# EAGLE design RPi_SPI_outputs_v04 (EAGLE 7.2.0)
AUTHOR: M.Petrilak; VERSION: 04
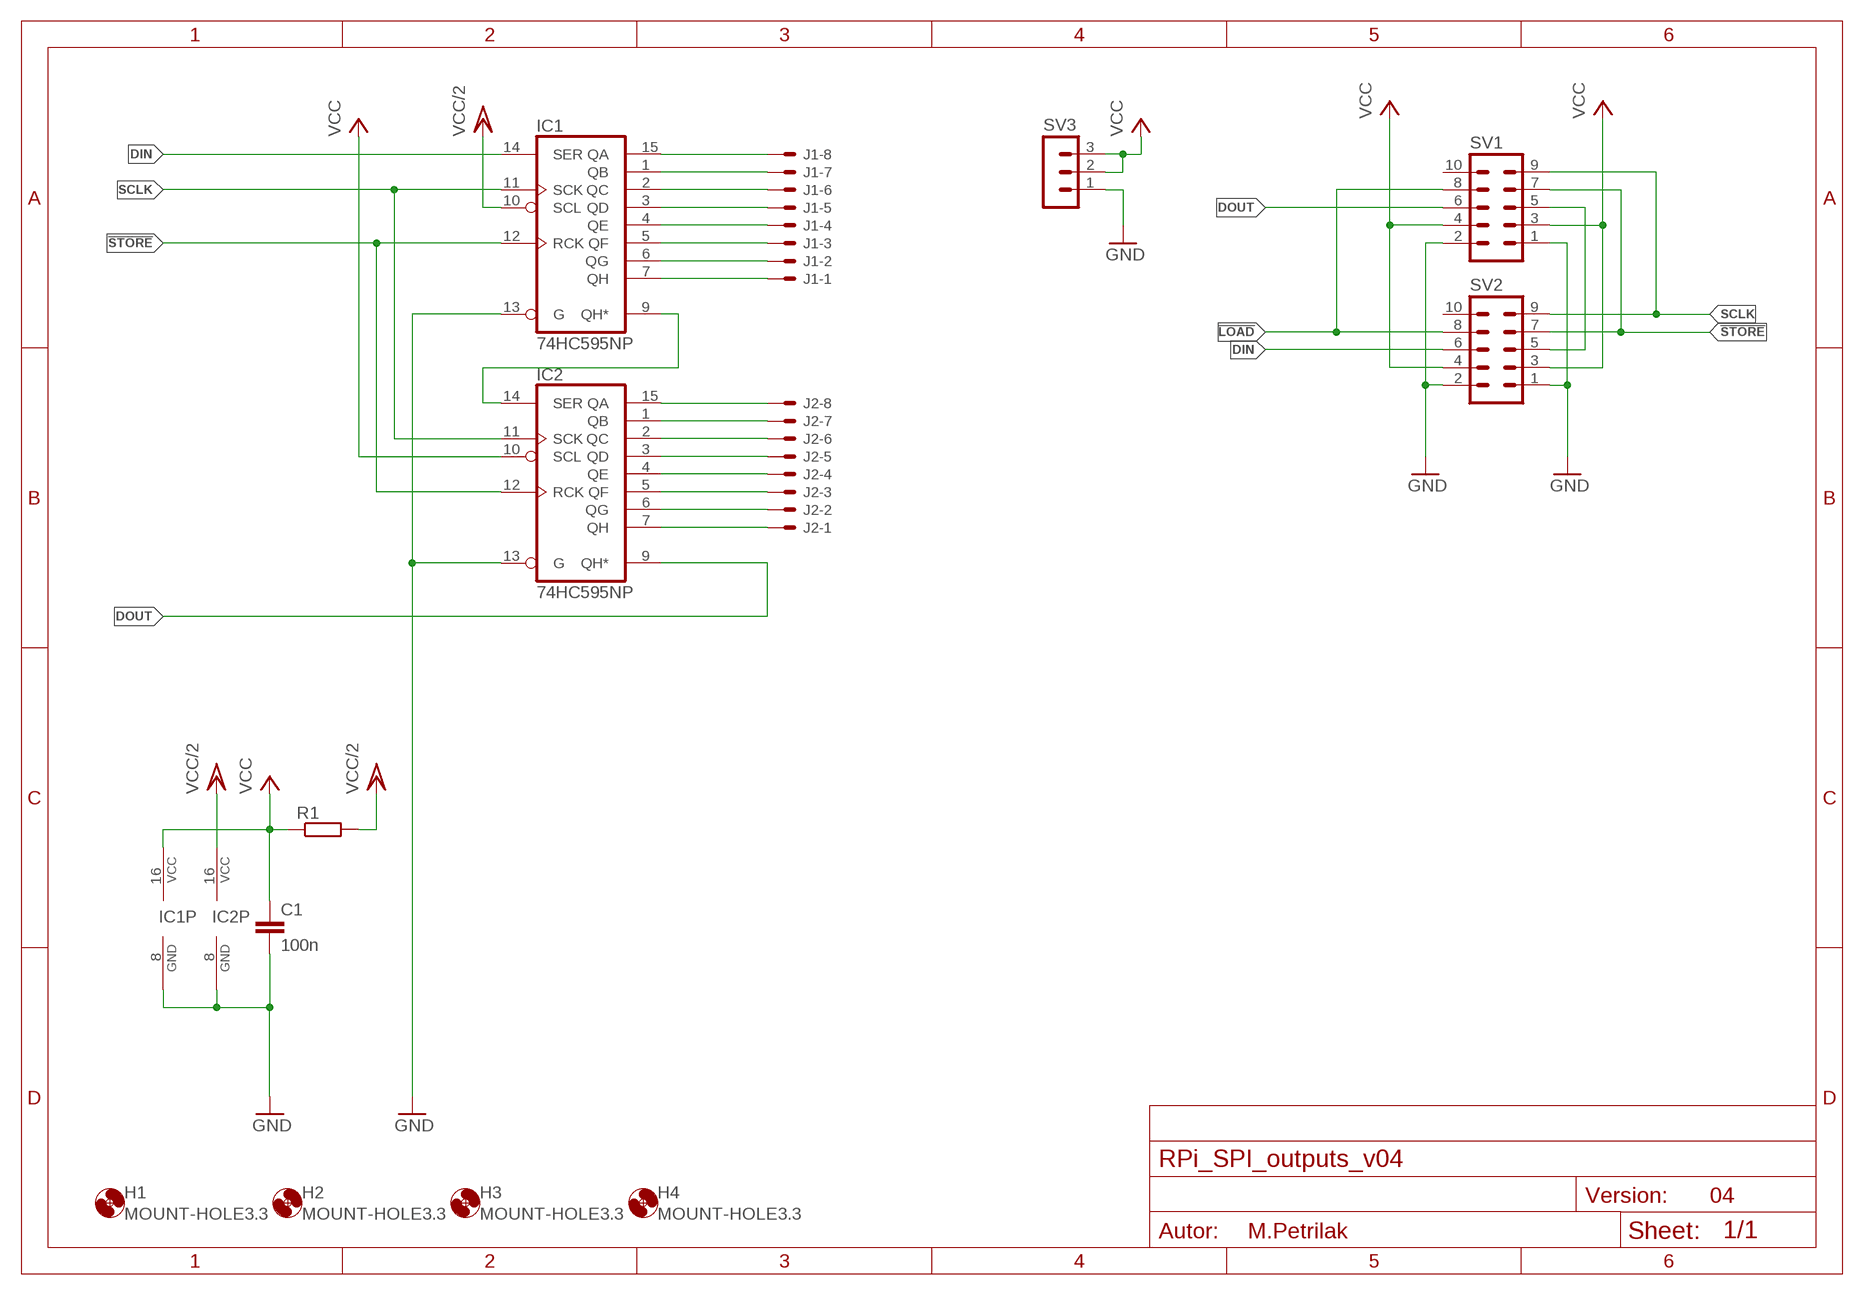
[diagram p0: schematic, sheet 1]

## Parts
C1  100n  C-EUC1206  [C1206]
H1  MOUNT-HOLE3.3  [3,3]
H2  MOUNT-HOLE3.3  [3,3]
H3  MOUNT-HOLE3.3  [3,3]
H4  MOUNT-HOLE3.3  [3,3]
IC1  74HC595NP  [SOCKET-16]
IC2  74HC595NP  [SOCKET-16]
J1  22-05-7088-SPEC-08  [7395-08_SPEC]
J2  22-05-7088-SPEC-08  [7395-08_SPEC]
R1  R-EU_R1206  [R1206]
SV1  ML10  [ML10]
SV2  ML10  [ML10]
SV3  MA03-1_NO  [MA03-1_NO]

## Nets
!LOAD: SV1.8 SV2.8
!STORE: IC1.12(RCK) IC2.12(RCK) SV1.7 SV2.7
DIN: IC1.14(SER) SV2.6
DOUT: IC2.9(QH*) SV1.6
DRET: SV1.5 SV2.5
GND: C1.2 IC1.8(GND) IC1.13(G) IC2.8(GND) IC2.13(G) SV1.1 SV1.2 SV2.1 SV2.2 SV3.1
N$1: IC1.15(QA) J1.8
N$2: IC1.1(QB) J1.7
N$3: IC1.2(QC) J1.6
N$4: IC1.3(QD) J1.5
N$5: IC1.4(QE) J1.4
N$6: IC1.5(QF) J1.3
N$7: IC1.6(QG) J1.2
N$8: IC1.7(QH) J1.1
N$9: IC2.15(QA) J2.8
N$10: IC2.1(QB) J2.7
N$11: IC2.2(QC) J2.6
N$12: IC2.3(QD) J2.5
N$13: IC2.4(QE) J2.4
N$14: IC2.5(QF) J2.3
N$15: IC2.6(QG) J2.2
N$16: IC2.7(QH) J2.1
N$17: IC1.9(QH*) IC2.14(SER)
SCLK: IC1.11(SCK) IC2.11(SCK) SV1.9 SV2.9
VCC: C1.1 IC1.16(VCC) IC2.10(SCL) R1.1 SV1.3 SV1.4 SV2.3 SV2.4 SV3.2 SV3.3
VCC/2: IC1.10(SCL) IC2.16(VCC) R1.2
Unconnected: SV1.10 SV2.10

## Library data of the parts
C1 = rcl:C-EU: CAPACITOR, European symbol
H1-H4 = holes:MOUNT-HOLE: MOUNTING HOLE with drill center marker
IC1 IC2 = 74xx-us:74*595: 8-bit SHIFT REGISTER, output latch
J1 J2 = con-molex:22-?-08: CONNECTOR wire to board 2.54 mm (.1 inch) pitch header
R1 = rcl:R-EU_: RESISTOR, European symbol
SV1 SV2 = con-harting-ml:ML10: HARTING
SV3 = con-lstb:MA03-1: PIN HEADER

## Board
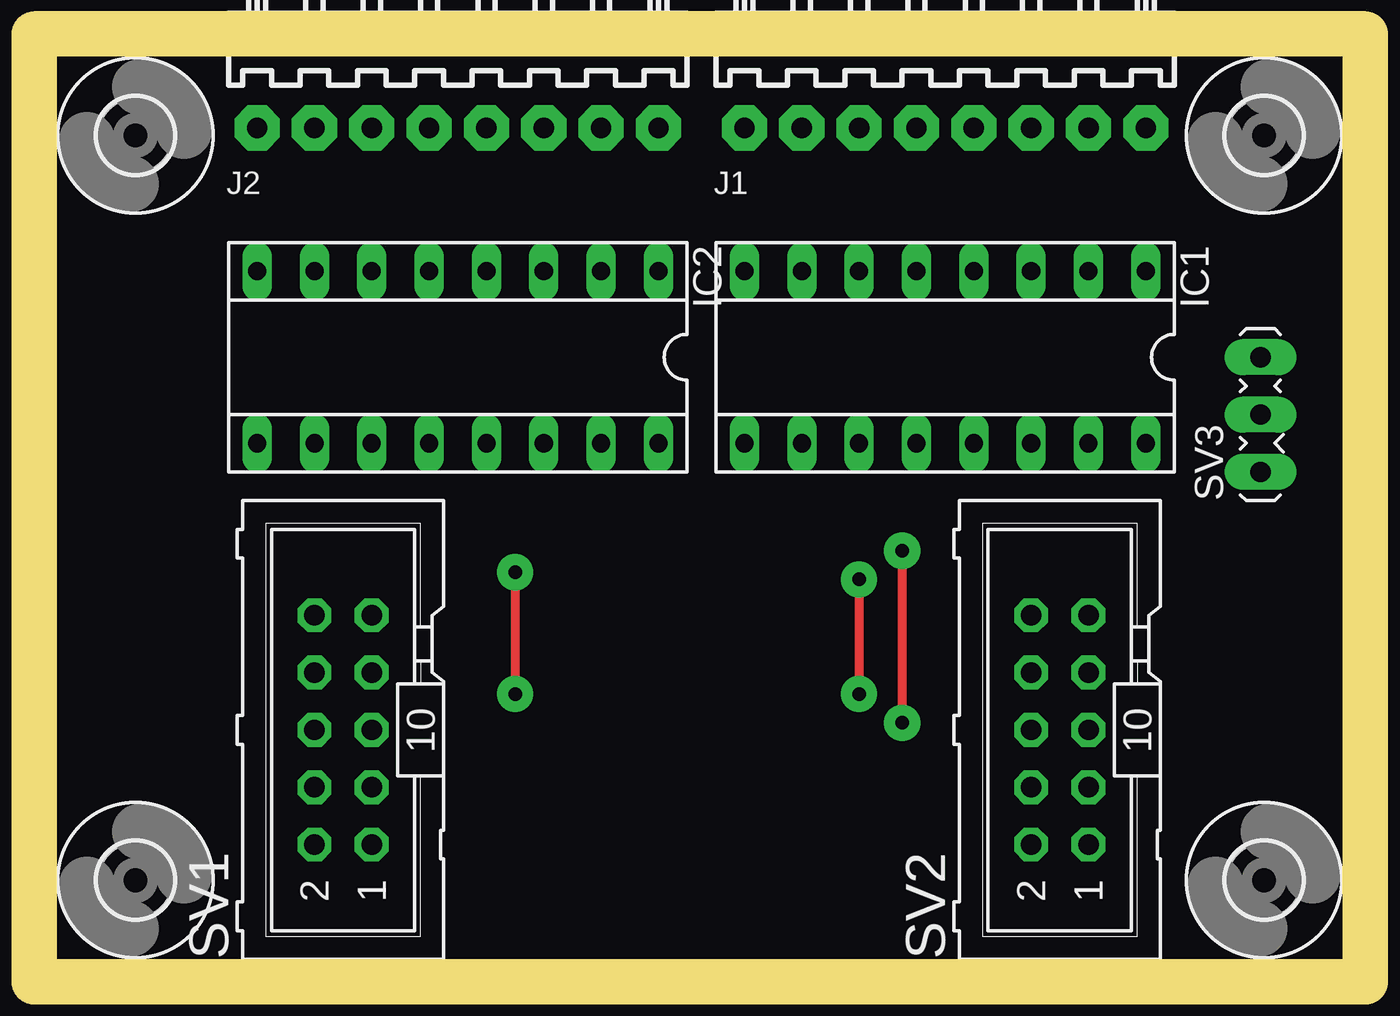
[diagram p1: board, top side]
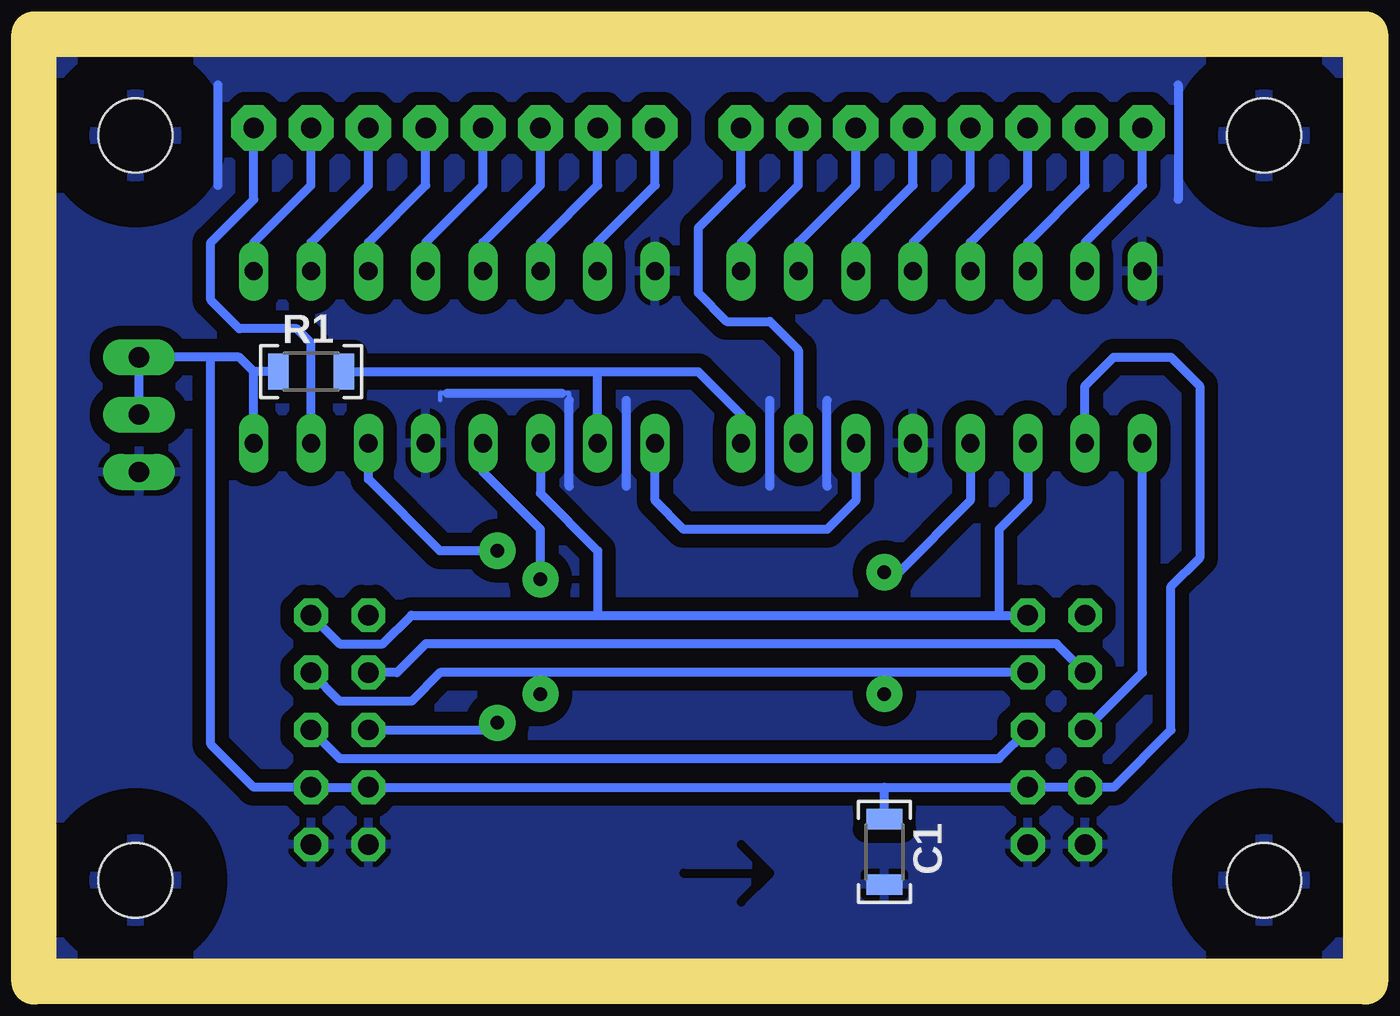
[diagram p2: board, bottom side, seen from below]

Size 57 x 40 mm. Coordinates in mm from the lower left corner, seen from the top.
Outline: 0,0 57,0 57,40 0,40 0,0
Copper layers (1*16): Top 0.035mm / dielectric 1.5mm / Bottom 0.035mm
Design rules "Michal_CNC_big": minimum track width 0.3mm, minimum drill 0.6mm, track to track 0.6mm, track to pad 0.8mm, pad to pad 0.6mm, via to via 0.4mm, smd to smd 8mil, copper to edge 1mil, drill to drill 8mil, minimum pad ring 10mil, minimum via ring 8mil, stop-mask expansion 4mil, vias tented up to drill 0mil, thermal gap 10mil
bRestrict: 3 lines
Milling: 4 lines

### Footprints (pad centres in the part's own frame; a part is rotated, then mirrored left to right if it is on the bottom)
C1206 = smd 0.9 x 1.6: 1 -1.45,0; 2 1.45,0
3,3 = hole 3.3: 0,0
SOCKET-16 = drill 0.8 long: 1 -8.89,-3.81; 2 -6.35,-3.81; 3 -3.81,-3.81; 4 -1.27,-3.81; 5 1.27,-3.81; 6 3.81,-3.81; 7 6.35,-3.81; 8 8.89,-3.81; 9 8.89,3.81; 10 6.35,3.81; 11 3.81,3.81; 12 1.27,3.81; 13 -1.27,3.81; 14 -3.81,3.81; 15 -6.35,3.81; 16 -8.89,3.81
7395-08_SPEC = drill 0.9 pad 2 octagon: 1 8.89,0; 2 6.35,0; 3 3.81,0; 4 1.27,0; 5 -1.27,0; 6 -3.81,0; 7 -6.35,0; 8 -8.89,0
R1206 = smd 0.9 x 1.6: 1 -1.45,0; 2 1.45,0
ML10 = drill 0.9 pad 1.5 octagon: 1 -5.08,-1.27; 2 -5.08,1.27; 3 -2.54,-1.27; 4 -2.54,1.27; 5 0,-1.27; 6 0,1.27; 7 2.54,-1.27; 8 2.54,1.27; 9 5.08,-1.27; 10 5.08,1.27
MA03-1_NO = drill 0.9 pad 1.6 long: 1 -2.54,0; 2 0,0; 3 2.54,0

### Placement (x,y rotation side)
C1  20.32,4.76 270 bottom
H1  3.5,3.5 0 top
H2  53.5,3.5 0 top
H3  53.5,36.5 0 top
H4  3.5,36.5 0 top
IC1  39.37,26.67 180 top
IC2  17.78,26.67 180 top
J1  39.37,36.83 180 top
J2  17.78,36.83 180 top
R1  45.72,26.04 0 bottom
SV1  12.7,10.16 90 top
SV2  44.45,10.16 90 top
SV3  53.34,24.13 90 top

### Tracks (layer width: path | path; a pad name or v marks a point on that pad's centre or on a via)
!LOAD
  Bottom 0.406: SV1.8 12.7,13.97 40.64,13.97 41.91,12.7 SV2.8
!STORE  (via drill 0.6 pad 1.6)
  Top 0.406: v20.32,17.14 v20.32,11.75 | v35.56,16.83 v35.56,11.75
  Bottom 0.406: v20.32,11.75 20.32,12.7 | v35.56,11.75 35.56,12.7 | IC2.12 16.51,20.32 19.68,17.14 v20.32,17.14 | SV1.7 20.32,12.7 | 20.32,12.7 35.56,12.7 | 35.56,12.7 40.01,12.7 41.27,11.43 44.45,11.43 SV2.7 | v35.56,16.83 35.56,19.05 38.1,21.59 IC1.12
DIN  (via drill 0.6 pad 1.6)
  Top 0.406: v37.47,18.1 v37.47,10.48
  Bottom 0.406: SV2.6 37.78,10.16 v37.47,10.48 | IC1.14 43.18,21.27 40.01,18.1 v37.47,18.1
DOUT
  Bottom 0.406: SV1.6 8.89,12.7 IC2.9
DRET
  Bottom 0.406: SV2.5 44.45,8.89 15.24,8.89 SV1.5
GND
  Bottom 0.19: 34.61,25.08 34.29,25.08 34.29,24.77 | 39.69,25.08 40.01,25.08 40.01,24.77
  Bottom 0.406: 7.3,38.73 7.3,33.66 | 49.85,38.73 49.85,34.29 | 25.4,20.95 25.4,24.77 | 22.86,20.95 22.86,24.77 | 31.75,20.95 31.75,24.77 | 34.29,20.95 34.29,24.77 | 39.69,25.08 34.61,25.08
  pour Bottom: 0,0 57,0 57,40 0,40
N$1
  Bottom 0.406: IC1.15 45.72,27.3 46.35,27.94 48.9,27.94 50.16,29.21 50.16,31.75 48.26,33.66 J1.8
N$2
  Bottom 0.406: IC1.1 48.26,31.75 45.72,34.29 J1.7
N$3
  Bottom 0.406: IC1.2 45.72,31.75 43.18,34.29 J1.6
N$4
  Bottom 0.406: IC1.3 43.18,31.75 40.64,34.29 J1.5
N$5
  Bottom 0.406: IC1.4 40.64,31.75 38.1,34.29 J1.4
N$6
  Bottom 0.406: IC1.5 38.1,31.75 35.56,34.29 J1.3
N$7
  Bottom 0.406: IC1.6 35.56,31.75 33.02,34.29 J1.2
N$8
  Bottom 0.406: IC1.7 33.02,31.75 30.48,34.29 J1.1
N$9
  Bottom 0.406: J2.8 26.67,34.29 28.57,32.38 28.57,29.53 27.3,28.26 25.4,28.26 24.13,26.99 IC2.15
N$10
  Bottom 0.406: IC2.1 26.67,31.75 24.13,34.29 J2.7
N$11
  Bottom 0.406: IC2.2 24.13,31.75 21.59,34.29 J2.6
N$12
  Bottom 0.406: IC2.3 21.59,31.75 19.05,34.29 J2.5
N$13
  Bottom 0.406: IC2.4 19.05,31.75 16.51,34.29 J2.4
N$14
  Bottom 0.406: IC2.5 16.51,31.75 13.97,34.29 J2.3
N$15
  Bottom 0.406: IC2.6 13.97,31.75 11.43,34.29 J2.2
N$16
  Bottom 0.406: IC2.7 11.43,31.75 8.89,34.29 J2.1
N$17
  Bottom 0.406: IC2.14 21.59,20.32 22.86,19.05 29.21,19.05 30.48,20.32 IC1.9
SCLK
  Bottom 0.406: SV2.9 44.45,13.97 42.55,13.97 41.27,15.24 33.02,15.24 | 33.02,15.24 15.24,15.24 | 15.24,15.24 SV1.9 | 15.24,15.24 15.24,19.05 13.97,20.32 IC2.11 | IC1.11 35.56,20.64 33.02,18.1 33.02,15.24
VCC
  Bottom 0.406: 20.32,7.62 SV2.4 SV2.3 48.26,7.62 50.16,9.53 50.16,26.67 | 20.32,7.62 SV1.3 SV1.4 10.16,7.62 7.62,10.16 7.62,16.51 6.35,17.78 6.35,25.4 7.62,26.67 10.16,26.67 11.43,25.4 IC2.10 | C1.1 20.32,7.62 | SV3.2 SV3.3 50.16,26.67 | IC1.16 48.26,26.04 | R1.1 48.26,26.04 | 48.26,26.04 48.9,26.67 50.16,26.67
VCC/2
  Bottom 0.406: R1.2 33.02,26.04 | 33.02,26.04 28.57,26.04 26.67,24.13 IC2.16 | IC1.10 33.02,26.04

### Text on the board
bRestrict: 2023